# EAGLE design Dodobot (EAGLE 9.6.2)
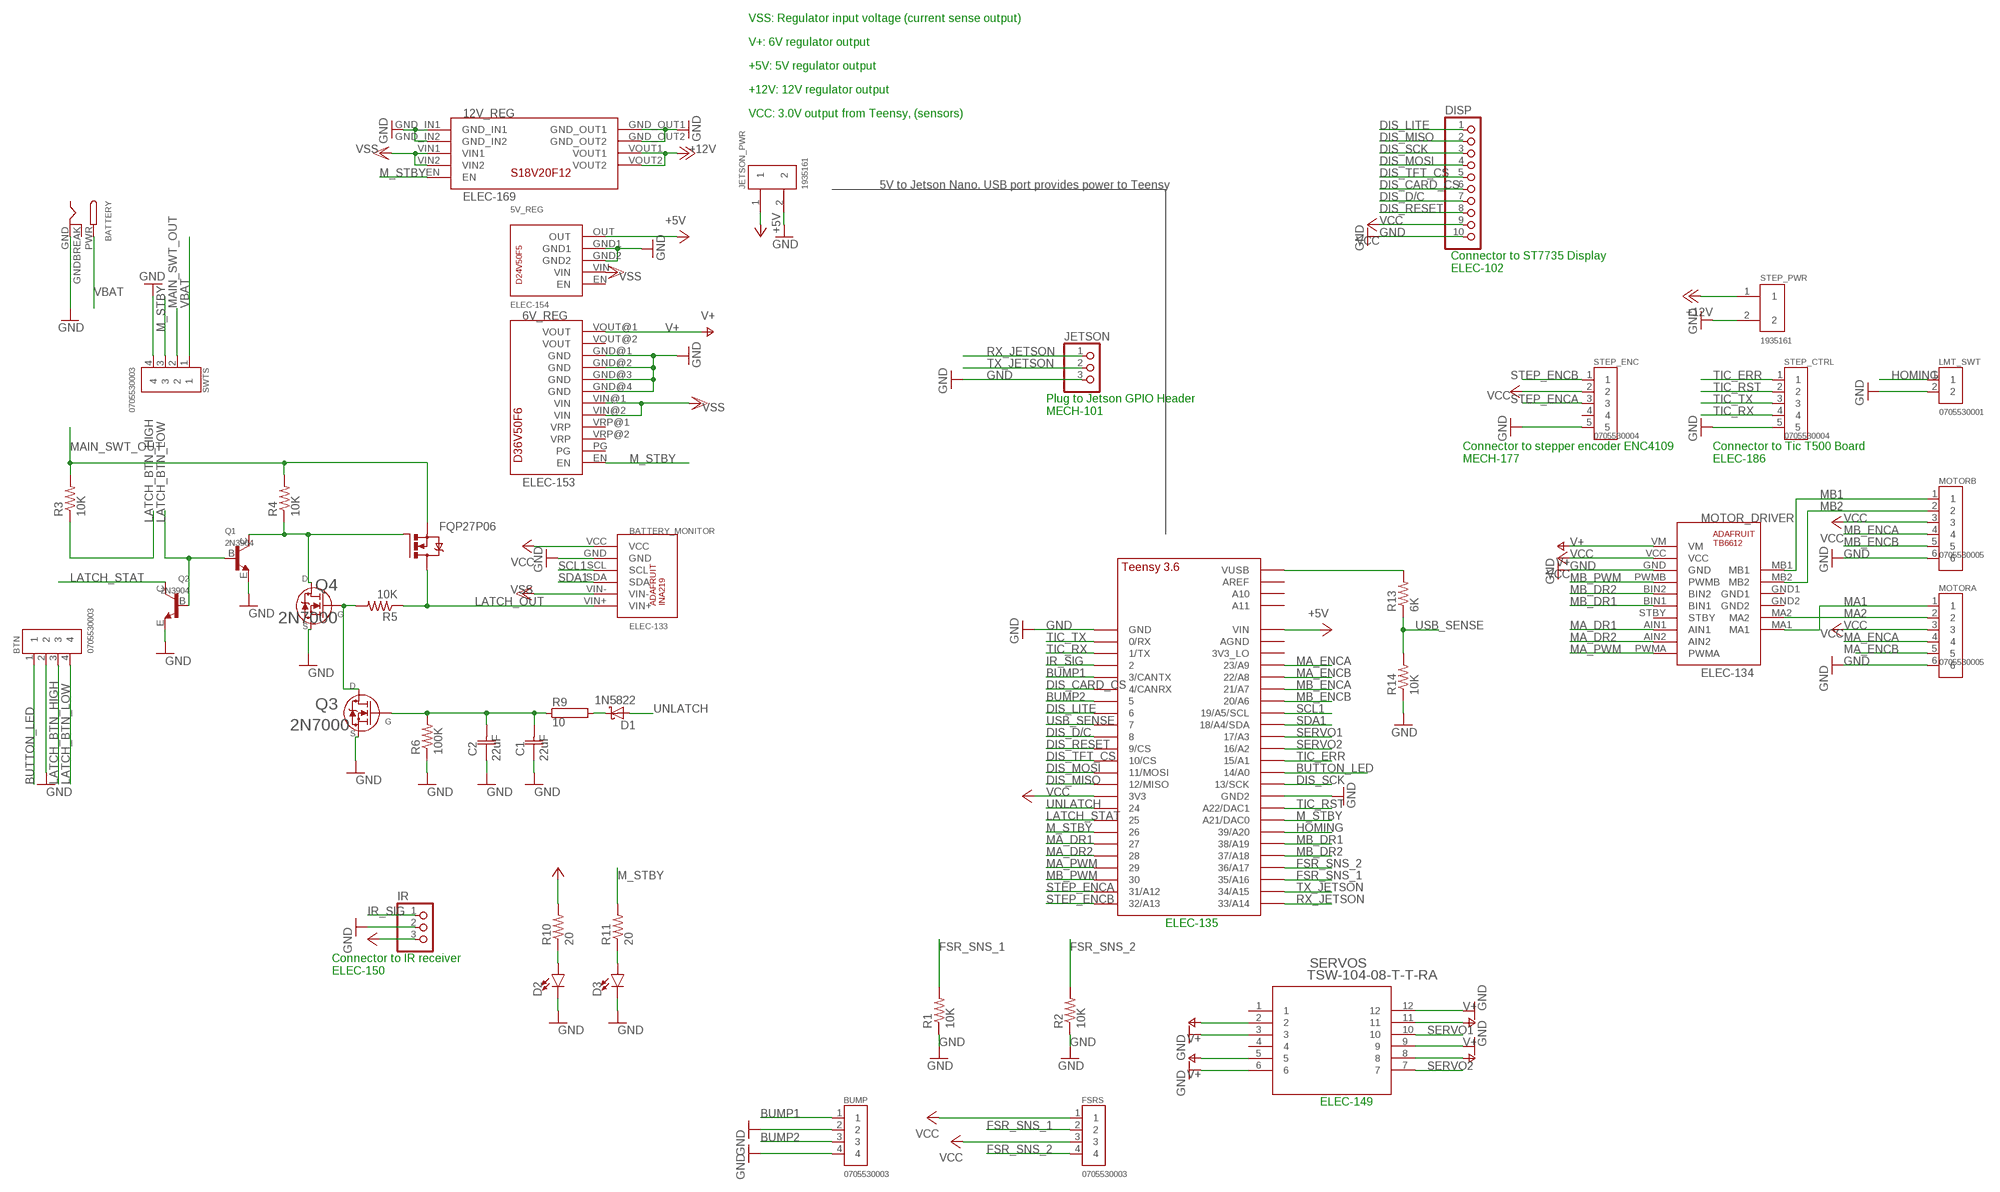
[diagram p0: schematic, sheet 1]

## Parts
5V_REG  ELEC-154  D24V50F5  [D24V50F5]
6V_REG  ELEC-153  D36V50FX  [D36V50FX]
12V_REG  ELEC-169  S18V20FX  [S18V20FX]
BATTERY  DCBARRELPTH  [DCJACK_2MM_PTH]
BATTERY_MONITOR  ELEC-133  INA219  [INA219]
BTN  0705530003  [MOLEX_0705530003]
BUMP  0705530003  [MOLEX_0705530003]
C1  22uF  FK24X5R0J226M  [CAP_R4525B]
C2  22uF  FK24X5R0J226M  [CAP_R4525B]
D1  1N5822  [DIOAD2120W130L950D530P]
D2  LED1206  [LED-1206]
D3  LED1206  [LED-1206]
DISP  PINHD-1X10  [1X10]
FQP27P06  IRF530  [TO220BV]
FSRS  0705530003  [MOLEX_0705530003]
IR  PINHD-1X3  [1X03]
JETSON  PINHD-1X3  [1X03]
JETSON_PWR  1935161  [PHOENIX_1935161]
LMT_SWT  0705530001  [MOLEX_0705530001]
MOTOR_DRIVER  ELEC-134  ADAFRUIT_TB6612  [ADAFRUIT_TB6612]
MOTORA  0705530005  [MOLEX_0705530005]
MOTORB  0705530005  [MOLEX_0705530005]
Q1  2N3904  [TO92]
Q2  2N3904  [TO92]
Q3  2N7000  [TO-92]
Q4  2N7000  [TO-92]
R1  10K  CRCW08050000Z0EA  [RES_0805]
R2  10K  CRCW08050000Z0EA  [RES_0805]
R3  10K  CRCW08050000Z0EA  [RES_0805]
R4  10K  CRCW08050000Z0EA  [RES_0805]
R5  10K  CRCW08050000Z0EA  [RES_0805]
R6  100K  CRCW08050000Z0EA  [RES_0805]
R9  10  RHPS58  [HPS58]
R10  20  WSLP1206R0500FEA  [RES_1206]
R11  20  WSLP1206R0500FEA  [RES_1206]
R13  6K  CRCW08050000Z0EA  [RES_0805]
R14  10K  CRCW08050000Z0EA  [RES_0805]
SERVOS  TSW-104-08-T-T-RA  [TSW-104-08-T-T-RA_SAI]
STEP_CTRL  0705530004  [MOLEX_0705530004]
STEP_ENC  0705530004  [MOLEX_0705530004]
STEP_PWR  1935161  [PHOENIX_1935161]
SWTS  0705530003  [MOLEX_0705530003]
U$1  TEENSY_3.5/3.6_BASIC  [TEENSY_3.5/3.6_BASIC]

## Nets
+5V: 5V_REG.OUT JETSON_PWR.1 U$1.VIN
+12V: 12V_REG.VOUT1 12V_REG.VOUT2 STEP_PWR.1
BUMP1: BUMP.1 U$1.3/CANTX
BUMP2: BUMP.3 U$1.5
BUTTON_LED: BTN.1 U$1.14/A0
DIS_CARD_CS: DISP.6 U$1.4/CANRX
DIS_D/C: DISP.7 U$1.8
DIS_LITE: DISP.1 U$1.6
DIS_MISO: DISP.2 U$1.12/MISO
DIS_MOSI: DISP.4 U$1.11/MOSI
DIS_RESET: DISP.8 U$1.9/CS
DIS_SCK: DISP.3 U$1.13/SCK
DIS_TFT_CS: DISP.5 U$1.10/CS
FSR_SNS_1: FSRS.2 R1.2 U$1.35/A16
FSR_SNS_2: FSRS.4 R2.2 U$1.36/A17
GND [ground]: 5V_REG.GND1 5V_REG.GND2 6V_REG.GND@1(GND) 6V_REG.GND@2(GND) 6V_REG.GND@3(GND) 6V_REG.GND@4(GND) 12V_REG.GND_IN1 12V_REG.GND_IN2 12V_REG.GND_OUT1 12V_REG.GND_OUT2 BATTERY.GND BATTERY_MONITOR.GND BTN.2 BUMP.2 BUMP.4 C1.1 C2.1 D2.C D3.C DISP.10 IR.2 JETSON.3 JETSON_PWR.2 LMT_SWT.2 MOTOR_DRIVER.GND MOTORA.6 MOTORB.6 Q1.E Q2.E Q3.1 Q4.1 R1.1 R2.1 R6.1 R14.1 SERVOS.3 SERVOS.6 SERVOS.9 SERVOS.12 STEP_CTRL.5 STEP_ENC.5 STEP_PWR.2 SWTS.4 U$1.GND U$1.GND2
HOMING: LMT_SWT.1 U$1.39/A20
IR_SIG: IR.1 U$1.2
LATCH_BTN_HIGH: BTN.3 R3.1
LATCH_BTN_LOW: BTN.4 Q1.B Q2.B
LATCH_OUT: BATTERY_MONITOR.VIN+ FQP27P06.D R5.1
LATCH_STAT: Q2.C U$1.25
M_STBY: 6V_REG.EN 12V_REG.EN R11.2 SWTS.3 U$1.21/DAC0(A21/DAC0) U$1.26
MA1 [power]: MOTOR_DRIVER.MA1 MOTORA.1
MA2: MOTOR_DRIVER.MA2 MOTORA.2
MA_DR1: MOTOR_DRIVER.AIN1 U$1.27
MA_DR2: MOTOR_DRIVER.AIN2 U$1.28
MA_ENCA: MOTORA.4 U$1.23/A9
MA_ENCB: MOTORA.5 U$1.22/A8
MA_PWM: MOTOR_DRIVER.PWMA U$1.29
MAIN_SWT_OUT: FQP27P06.S R3.2 R4.2 SWTS.2
MB1 [power]: MOTOR_DRIVER.MB1 MOTORB.1
MB2: MOTOR_DRIVER.MB2 MOTORB.2
MB_DR1: MOTOR_DRIVER.BIN1 U$1.38/A19
MB_DR2: MOTOR_DRIVER.BIN2 U$1.37/A18
MB_ENCA: MOTORB.4 U$1.21/A7
MB_ENCB: MOTORB.5 U$1.20/A6
MB_PWM: MOTOR_DRIVER.PWMB U$1.30
N$2: D2.A R10.1
N$3: D3.A R11.1
N$8: FQP27P06.G Q1.C Q4.3 R4.1
N$9: Q3.3 Q4.2 R5.2
N$10: D1.C R9.2
N$11: C1.2 C2.2 Q3.2 R6.2 R9.1
N$14: R13.2 U$1.VUSB
RX_JETSON: JETSON.1 U$1.33/A14
SCL1: BATTERY_MONITOR.SCL U$1.19/A5/SCL
SDA1: BATTERY_MONITOR.SDA U$1.18/A4/SDA
SERVO1: SERVOS.10 U$1.17/A3
SERVO2: SERVOS.7 U$1.16/A2
STEP_ENCA: STEP_ENC.3 U$1.31/A12
STEP_ENCB: STEP_ENC.1 U$1.32/A13
TIC_ERR: STEP_CTRL.1 U$1.15/A1
TIC_RST: STEP_CTRL.2 U$1.A22/DAC1
TIC_RX: STEP_CTRL.4 U$1.1/TX
TIC_TX: STEP_CTRL.3 U$1.0/RX
TX_JETSON: JETSON.2 U$1.34/A15
UNLATCH: D1.A U$1.24
USB_SENSE: R13.1 R14.2 U$1.7
V+: 6V_REG.VOUT@1(VOUT) MOTOR_DRIVER.VM SERVOS.2 SERVOS.5 SERVOS.8 SERVOS.11
VBAT [power]: BATTERY.PWR SWTS.1
VCC: BATTERY_MONITOR.VCC DISP.9 FSRS.1 FSRS.3 IR.3 MOTOR_DRIVER.VCC MOTORA.3 MOTORB.3 R10.2 STEP_ENC.2 U$1.3V3
VSS [power]: 5V_REG.VIN 6V_REG.VIN@1(VIN) 6V_REG.VIN@2(VIN) 12V_REG.VIN1 12V_REG.VIN2 BATTERY_MONITOR.VIN-
Unconnected: 5V_REG.EN 6V_REG.PG 6V_REG.VOUT@2(VOUT) 6V_REG.VRP@1(VRP) 6V_REG.VRP@2(VRP) MOTOR_DRIVER.GND1 MOTOR_DRIVER.GND2 MOTOR_DRIVER.STBY SERVOS.1 SERVOS.4 STEP_ENC.4 U$1.3V3_LO U$1.A10 U$1.A11 U$1.AGND U$1.AREF

## Notes on the sheet
- VSS: Regulator input voltage (current sense output)
- V+: 6V regulator output
- +5V: 5V regulator output
- +12V: 12V regulator output
- VCC: 3.0V output from Teensy, (sensors)
- 5V to Jetson Nano. USB port provides power to Teensy
- Connector to ST7735 Display
  ELEC-102
- Plug to Jetson GPIO Header
  MECH-101
- Connector to stepper encoder ENC4109
  MECH-177
- Connector to Tic T500 Board
  ELEC-186
- ELEC-135
- Connector to IR receiver
  ELEC-150
- ELEC-149

## Power pins joined to a net without a drawn wire
GNDBREAK: BATTERY.GNDBREAK

## Library data of the parts
5V_REG = D24V50F5:D24V50F5
6V_REG = D36V50Fx:D36V50FX
12V_REG = S18V20FX:S18V20FX
BATTERY = adafruit:DCBARREL: 2.0mm DC Barrel Jack DCJACK_2MM_PTH - Through Hole Jack (4UConnector: 05537)
BATTERY_MONITOR = adafruit_INA219:INA219
BTN BUMP FSRS SWTS = Molex Right Angle 4 position 0705530003:0705530003: Conn Shrouded Header HDR 4 POS 2.54mm Solder RA Thru-Hole; DESCRIPTION: Connector Header Through Hole, Right Angle 4 position 0.100 (2.54mm); DIGI-KEY_PART_NUMBER: WM4902-ND; MF: Molex; MP: 0705530003; PACKAGE: None
C1 C2 = FK24X5R0J226M:FK24X5R0J226M; BUILT_BY: EMA_UL_Team; MANUFACTURER_PART_NUMBER: FK24X5R0J226M; VENDOR: TDK
D1 = 1N5822:1N5822: 1N5822 Series 40 V 3 A Through Hole Schottky Rectifier - DO-201AD; DIGI-KEY_PART_NUMBER: 1N5822FSCT-ND; DIGI-KEY_PURCHASE_URL: https://www.digikey.com/product-detail/en/on-semiconductor/1N5822/1N5822FSCT-ND/3042493?utm_source=snapeda&utm_medium=aggregator&utm_campaign=symbol; MF: ON Semiconductor; MP: 1N5822; PACKAGE: DO-201AD-201 CDIL
D2 D3 = SparkFun-LED:LED: LED (Generic) Standard schematic elements and footprints for 5mm, 3mm, 1206, and 0603 sized LEDs. Generic LEDs with no color specified.
DISP = pinhead:PINHD-1X10: PIN HEADER
FQP27P06 = IRF530:IRF530: HEXFET Power MOSFET; AVAILABILITY: Unavailable; MF: Vishay Siliconix; MP: IRF530; PACKAGE: TO-220-3 Samsung; PRICE: None
IR JETSON = pinhead:PINHD-1X3: PIN HEADER
JETSON_PWR STEP_PWR = 1935161:1935161: Conn Terminal Blocks 2 POS 5mm Solder ST Thru-Hole 16A; DESCRIPTION: Conn Terminal Blocks 2 POS 5mm Solder ST Thru-Hole 16A; DIGI-KEY_PART_NUMBER: 277-1667-ND; DIGI-KEY_PURCHASE_URL: https://www.digikey.com/product-detail/en/phoenix-contact/1935161/277-1667-ND/568614?utm_source=snapeda&utm_medium=aggregator&utm_campaign=symbol; MF: Phoenix Contact; MP: 1935161; PACKAGE: None
LMT_SWT = Molex Right Angle 4 position 0705530003:0705530001
MOTOR_DRIVER = adafruit_TB6612:ADAFRUIT_TB6612
MOTORA MOTORB = Molex Right Angle 4 position 0705530003:0705530005
Q1 Q2 = 2N3904:2N3904
Q3 Q4 = 2N7000:2N7000; BUILT_BY: EMA_UL_Team; MANUFACTURER_PART_NUMBER: 2N7000; VENDOR: STMicroelectronics
R1-R6 R13 R14 = Resistor_Capacitor:CRCW08050000Z0EA: RES SMD 0 OHM JUMPER 1/8W 0805 Manufacturer's datasheet <http://www.vishay.com/docs/20035/dcrcwe3.pdf>; CREATED_BY: PCBLayout.com; DIGIKEY_PART_NUMBER: 541-0.0ATR-ND; MANUFACTURER: Vishay Dale; MPN: CRCW08050000Z0EA; PACKAGE: SMD 0805
R9 = resistor-power:R: Power Resitor; OC_FARNELL: unknown; OC_NEWARK: unknown
R10 R11 = Resistor_Capacitor:WSLP1206R0500FEA: RES 0.05 OHM 1% 1W 1206 Manufacturer's datasheet <http://www.vishay.com/docs/30122/wslp.pdf>; CREATED_BY: PCBLayout.com; DIGIKEY_PART_NUMBER: WSLP-.05TR-ND; MANUFACTURER: Vishay Dale; MPN: WSLP1206R0500FEA; PACKAGE: SMD 1206
SERVOS = 4X3 Header Pin:TSW-104-08-T-T-RA; BUILT_BY: EMA_UL_Team; MANUFACTURER_PART_NUMBER: TSW-104-08-T-T-RA; SOURCELIBRARY: Samtec_2016-10-07_8; VENDOR: Samtec Inc
STEP_CTRL STEP_ENC = Molex Right Angle 4 position 0705530003:0705530004
U$1 = Teensy356:TEENSY_3.5/3.6_BASIC

## Net classes
0 default: width 0.203 mm, drill 0.152 mm, clearance 0.102 mm
1 power: width 0.813 mm, drill 0.61 mm, clearance 0.203 mm
2 ground: width 0.813 mm, drill 0.61 mm, clearance 0.203 mm

## Board
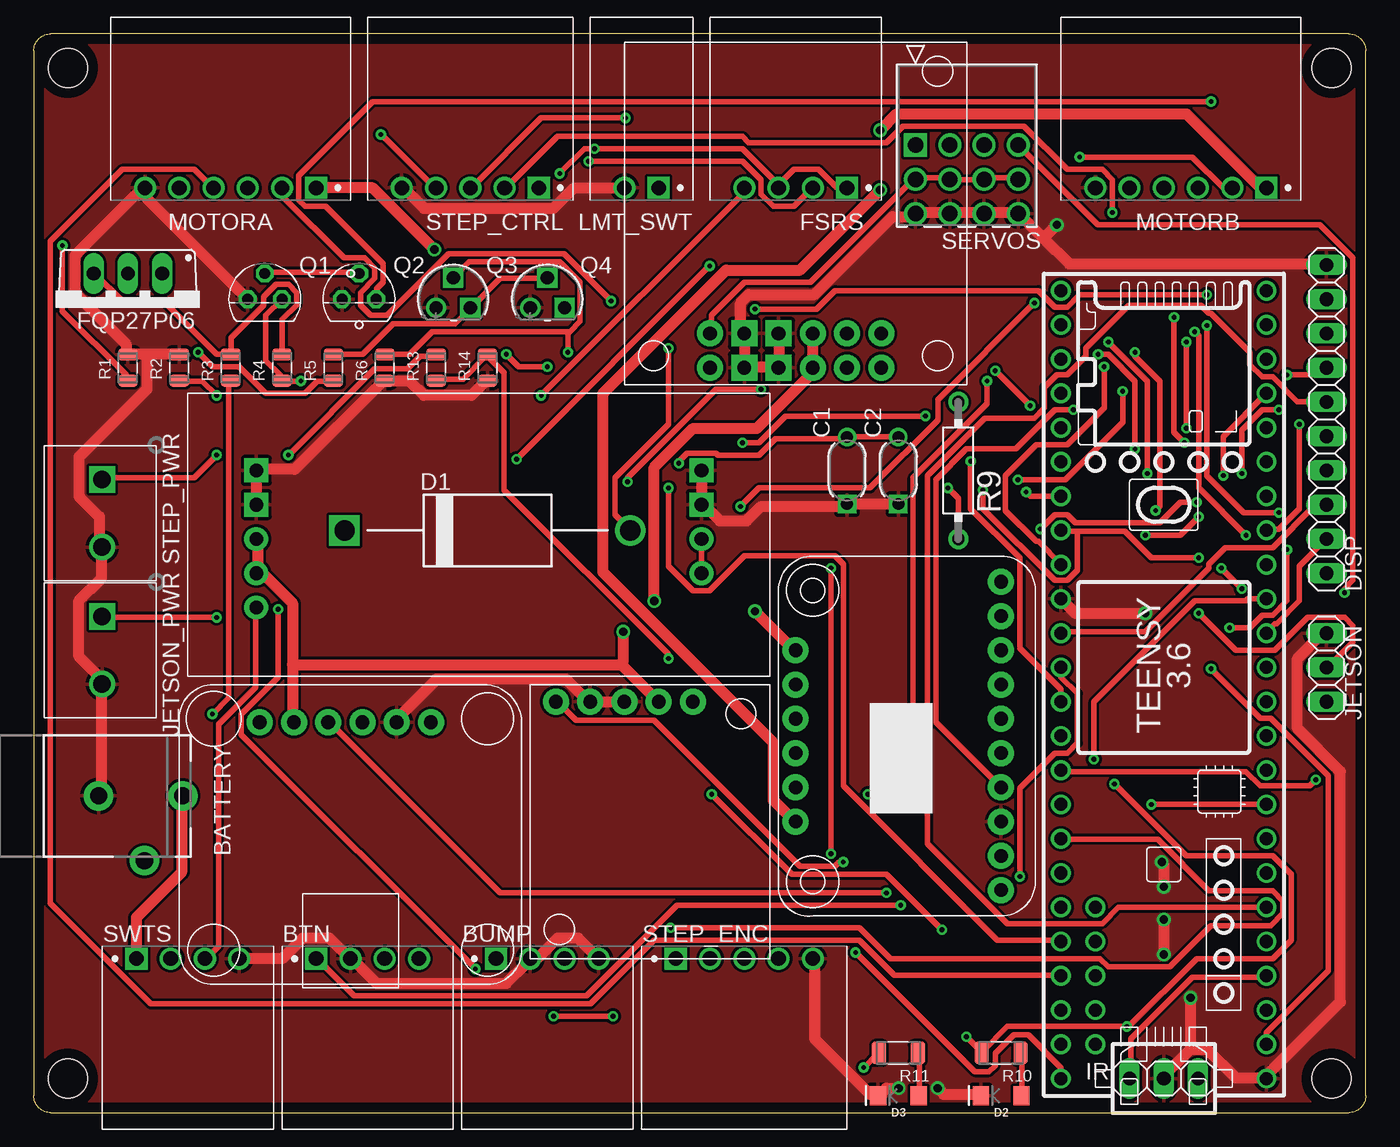
[diagram p1: board, top side]
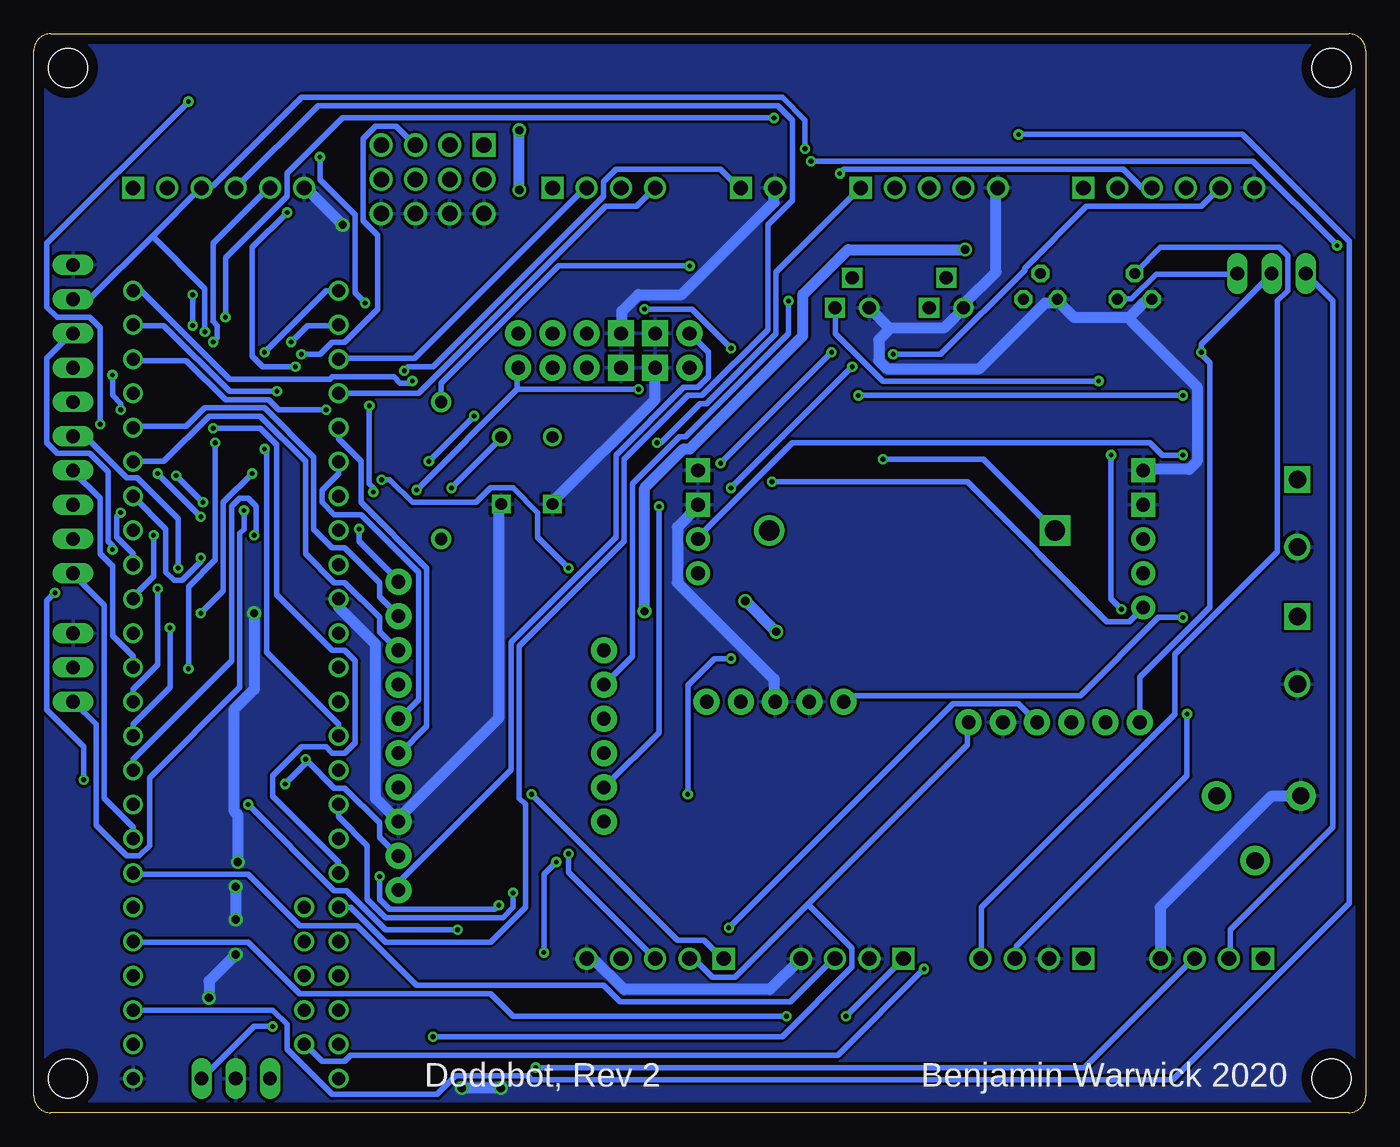
[diagram p2: board, bottom side, seen from below]

Size 98.81 x 80.01 mm. Coordinates in mm from the lower left corner, seen from the top.
Outline: 1.27,0 97.54,0 arc90 98.81,1.27 98.81,78.74 arc90 97.54,80.01 1.27,80.01 arc90 0,78.74 0,1.27 arc90 1.27,0
Copper layers (1*16): Top 0.035mm / dielectric 1.5mm / Bottom 0.035mm
Design rules "default *": minimum track width 16mil, minimum drill 0.35mm, track to track 8mil, track to pad 8mil, pad to pad 8mil, via to via 8mil, smd to smd 6mil, copper to edge 30mil, drill to drill 6mil, minimum pad ring 10mil, minimum via ring 8mil, stop-mask expansion 4mil, vias tented up to drill 0mil, thermal gap 10mil
Holes 2.92 mm at 2.54,77.47 96.27,77.47 2.54,2.54 96.27,2.54

### Footprints (pad centres in the part's own frame; a part is rotated, then mirrored left to right if it is on the bottom)
D24V50F5 = drill 1.016 pad 1.93: EN 5.715,1.27; GND1 10.795,1.27; GND2 13.335,1.27; OUT 15.875,1.27; VIN 8.255,1.27
D36V50FX = drill 1.016 pad 1.93: EN 19.05,1.27; PG 19.05,3.81; VIN@1 13.97,3.81; VIN@2 13.97,1.27; VOUT@1 6.35,3.81; VOUT@2 6.35,1.27; VRP@1 16.51,3.81; VRP@2 16.51,1.27 | drill 1.016 pad 1.93 square: GND@1 8.89,3.81; GND@2 8.89,1.27; GND@3 11.43,3.81; GND@4 11.43,1.27
S18V20FX = drill 1.016 pad 1.778: EN 5.08,5.08; VIN1 5.08,10.16; VIN2 5.08,7.62; VOUT1 38.1,10.16; VOUT2 38.1,7.62 | drill 1.016 pad 1.778 square: GND_IN1 5.08,15.24; GND_IN2 5.08,12.7; GND_OUT1 38.1,15.24; GND_OUT2 38.1,12.7
DCJACK_2MM_PTH = drill 1.27 pad 2.184: GND 0,7.35; GNDBREAK 4.8,10.75; PWR 0,13.6
INA219 = drill 1.016 pad 1.93: GND 9.271,2.794; SCL 11.811,2.794; SDA 14.351,2.794; VCC 6.731,2.794; VIN+ 19.431,2.794; VIN- 16.891,2.794
MOLEX_0705530003 = drill 1.09 square: 1 0,0 | drill 1.09: 2 2.54,0; 3 5.08,0; 4 7.62,0
CAP_R4525B = drill 0.864 pad 1.372 square: 1 -2.489,0 | drill 0.864 pad 1.372: 2 2.489,0
DIOAD2120W130L950D530P = drill 1.5 pad 2.25: A 10.6,0 | drill 1.5 pad 2.25 square: C -10.6,0
LED-1206 = smd 1.2 x 1.4: A -1.5,0; C 1.5,0
1X10 = drill 1.016 long: 1 -11.43,0; 2 -8.89,0; 3 -6.35,0; 4 -3.81,0; 5 -1.27,0; 6 1.27,0; 7 3.81,0; 8 6.35,0; 9 8.89,0; 10 11.43,0
TO220BV = drill 1.016 long: D 0,-2.54; G -2.54,-2.54; S 2.54,-2.54
1X03 = drill 1.016 long: 1 -2.54,0; 2 0,0; 3 2.54,0
PHOENIX_1935161 = drill 1.3 square: 1 -2.5,0 | drill 1.3: 2 2.5,0
MOLEX_0705530001 = drill 1.09 square: 1 0,0 | drill 1.09: 2 2.54,0
ADAFRUIT_TB6612 = drill 1.016 pad 1.93: AIN1 2.54,6.985; AIN2 2.54,4.445; BIN1 2.54,12.065; BIN2 2.54,14.605; GND 2.54,19.685; GND1 17.78,14.605; GND2 17.78,12.065; MA1 17.78,6.985; MA2 17.78,9.525; MB1 17.78,19.685; MB2 17.78,17.145; PWMA 2.54,1.905; PWMB 2.54,17.145; STBY 2.54,9.525; VCC 2.54,22.225; VM 2.54,24.765
MOLEX_0705530005 = drill 1.09 square: 1 0,0 | drill 1.09: 2 2.54,0; 3 5.08,0; 4 7.62,0; 5 10.16,0; 6 12.7,0
TO92 = drill 0.813 octagon: B 0,1.905; C 1.27,0; E -1.27,0
TO-92 = drill 0.991 pad 1.499: 1 -2.54,-1.905 | drill 0.991 pad 1.499 square: 2 -1.27,0.318; 3 0,-1.905
RES_0805 = smd 0.87 x 1.42: 1 -0.975,0; 2 0.975,0
HPS58 = drill 0.9 pad 1.5: 1 -5.08,0; 2 5.08,0
RES_1206 = smd 1.08 x 1.68: 1 -1.445,0; 2 1.445,0
TSW-104-08-T-T-RA_SAI = drill 1.143 pad 1.651 square: 1 0,0 | drill 1.143 pad 1.651: 2 0,-2.54; 3 0,-5.08; 4 2.54,0; 5 2.54,-2.54; 6 2.54,-5.08; 7 5.08,0; 8 5.08,-2.54; 9 5.08,-5.08; 10 7.62,0; 11 7.62,-2.54; 12 7.62,-5.08
MOLEX_0705530004 = drill 1.09 square: 1 0,0 | drill 1.09: 2 2.54,0; 3 5.08,0; 4 7.62,0; 5 10.16,0
TEENSY_3.5/3.6_BASIC = drill 0.965: 0/RX -25.4,-7.62; 1/TX -22.86,-7.62; 2 -20.32,-7.62; 3/CANTX -17.78,-7.62; 3V3 7.62,-7.62; 3V3_LO -22.86,7.62; 4/CANRX -15.24,-7.62; 5 -12.7,-7.62; 6 -10.16,-7.62; 7 -7.62,-7.62; 8 -5.08,-7.62; 9/CS -2.54,-7.62; 10/CS 0,-7.62; 11/MOSI 2.54,-7.62; 12/MISO 5.08,-7.62; 13/SCK 5.08,7.62; 14/A0 2.54,7.62; 15/A1 0,7.62; 16/A2 -2.54,7.62; 17/A3 -5.08,7.62; 18/A4/SDA -7.62,7.62; 19/A5/SCL -10.16,7.62; 20/A6 -12.7,7.62; 21/A7 -15.24,7.62; 21/DAC0 12.7,7.62; 22/A8 -17.78,7.62; 23/A9 -20.32,7.62; 24 10.16,-7.62; 25 12.7,-7.62; 26 15.24,-7.62; 27 17.78,-7.62; 28 20.32,-7.62; 29 22.86,-7.62; 30 25.4,-7.62; 31/A12 27.94,-7.62; 32/A13 30.48,-7.62; 33/A14 30.48,7.62; 34/A15 27.94,7.62; 35/A16 25.4,7.62; 36/A17 22.86,7.62; 37/A18 20.32,7.62; 38/A19 17.78,7.62; 39/A20 15.24,7.62; A10 -17.78,5.08; A11 -15.24,5.08; A22/DAC1 10.16,7.62; AGND -25.4,7.62; AREF -20.32,5.08; GND -27.94,-7.62; GND2 7.62,7.62; NC1 -22.86,5.08; VIN -27.94,7.62; VUSB -25.4,5.08

### Placement (x,y rotation side)
5V_REG  54.61,31.75 180 top
6V_REG  43.81,53.98 0 top
12V_REG  11.43,32.38 0 top
BATTERY  -2.54,23.5 270 top
BATTERY_MONITOR  36.2,31.75 180 top
BTN  20.95,11.43 0 top
BUMP  34.29,11.43 0 top
C1  60.33,47.62 90 top
C2  64.14,47.62 90 top
D1  33.66,43.18 0 top
D2  71.75,1.27 180 top
D3  64.14,1.27 180 top
DISP  95.89,51.44 90 top
FQP27P06  6.99,59.69 180 top
FSRS  60.33,68.58 180 top
IR  83.82,2.54 0 top
JETSON  95.89,33.02 90 top
JETSON_PWR  5.08,34.29 270 top
LMT_SWT  46.35,68.58 180 top
MOTOR_DRIVER  74.3,41.27 180 top
MOTORA  20.95,68.58 180 top
MOTORB  91.44,68.58 180 top
Q1  17.14,60.33 0 top
Q2  24.13,60.33 0 top
Q3  32.38,61.59 0 top
Q4  39.37,61.59 0 top
R1  6.99,55.24 270 top
R2  10.79,55.24 270 top
R3  14.61,55.24 90 top
R4  18.41,55.24 90 top
R5  22.23,55.24 90 top
R6  26.04,55.24 90 top
R9  68.58,47.62 90 top
R10  71.75,4.45 180 top
R11  64.14,4.45 180 top
R13  29.84,55.24 90 top
R14  33.66,55.24 90 top
SERVOS  65.41,71.75 0 top
STEP_CTRL  37.47,68.58 180 top
STEP_ENC  47.62,11.43 0 top
STEP_PWR  5.08,44.45 270 top
SWTS  7.62,11.43 0 top
U$1  83.82,30.48 90 top

### Tracks (layer width: path | path; a pad name or v marks a point on that pad's centre or on a via)
+5V  (via drill 0.35)
  Top 0.406: U$1.VIN 76.2,3.35 73.76,5.79 72.69,5.79 71.32,4.42 71.32,3.5 70.87,3.05 69.8,3.05 v60.96,11.89 | v60.05,18.59 59.74,18.59 59.44,18.29 56.84,18.29 46.02,29.11 40.23,29.11 38.86,30.48 5V_REG.OUT | v13.56,36.73 5.18,36.73 JETSON_PWR.1
  Bottom 0.406: v60.96,11.89 60.96,17.68 v60.05,18.59 | v13.56,36.73 15.39,36.73 21.18,30.94 38.25,30.94 38.71,30.48 5V_REG.OUT
+12V  (via drill 0.35)
  Top 0.406: 12V_REG.VOUT1 12V_REG.VOUT2 | v13.56,48.77 11.89,47.09 5.18,47.09 STEP_PWR.1
  Bottom 0.406: v13.56,48.77 15.09,48.77 16,49.68 42.52,49.68 49.53,42.67 12V_REG.VOUT1
BUMP1  (via drill 0.35)
  Top 0.406: v38.56,7.16 v42.98,7.16
  Bottom 0.406: v42.98,7.16 63.25,7.16 64.92,8.84 79.1,8.84 82.91,12.65 91.44,12.65 U$1.3/CANTX | BUMP.1 v38.56,7.16
BUMP2
  Bottom 0.406: U$1.5 91.44,17.68 82.91,17.68 79.1,13.87 74.83,13.87 70.41,9.45 56.54,9.45 55.32,8.23 42.67,8.23 39.47,11.43 BUMP.3
BUTTON_LED  (via drill 0.35)
  Top 0.406: U$1.14/A0 76.2,32.31 77.42,31.09 77.42,27.43 76.66,26.67 75.74,26.67 73.15,24.08 v73.15,17.53 | v64.31,15.39 47.7,15.39 41,8.69 23.77,8.69 21.03,11.43 BTN.1
  Bottom 0.406: v73.15,17.53 73.15,15.85 72.39,15.09 64.62,15.09 v64.31,15.39
DIS_CARD_CS
  Top 0.406: U$1.4/CANRX 80.47,15.24 79.25,14.02 72.24,14.02 66.29,19.96 66.29,47.24 70.56,51.51 74.22,51.51 74.98,52.27 74.98,53.8 75.89,54.71 76.66,54.71 78.03,56.08 78.03,56.69 81.23,59.89 86.56,59.89 87.17,59.28 87.33,59.28 90.22,56.39 90.22,55.47 91.14,54.56 91.9,54.56 93.73,52.73 95.86,52.73 DISP.6
DIS_D/C  (via drill 0.35)
  Top 0.406: v82.45,42.82 85.04,42.82 v86.41,44.2 | v89.61,47.4 89.61,50.6 91.14,52.12 v92.35,52.12 | v92.96,54.71 95.4,54.71 95.86,55.17 DISP.7
  Bottom 0.406: U$1.8 91.44,26.21 84.12,33.53 84.12,44.96 83.52,45.57 82.91,45.57 82.3,44.96 82.3,42.98 v82.45,42.82 | v89.61,47.4 v86.41,44.2 | v92.35,52.12 92.35,52.58 92.96,53.19 v92.96,54.71
DIS_LITE
  Bottom 0.406: U$1.6 91.44,21.18 93.57,23.32 93.57,37.64 95.86,39.93 DISP.1
DIS_MISO
  Top 0.406: DISP.2 93.88,40.54 93.88,37.95 92.2,36.27 92.05,36.27 91.44,35.66 U$1.12/MISO
DIS_MOSI
  Bottom 0.406: U$1.11/MOSI 91.44,33.83 92.96,35.36 92.96,40.54 93.88,41.45 93.88,45.57 95.86,47.55 DISP.4
DIS_RESET  (via drill 0.35)
  Top 0.406: v88.7,35.97 90.22,35.97 91.14,36.88 91.9,36.88 92.96,37.95 v92.96,41.76
  Bottom 0.406: U$1.9/CS 91.44,28.8 88.7,31.55 v88.7,35.97 | v92.96,41.76 92.96,42.06 93.27,42.37 93.27,47.55 94.64,48.92 97.08,48.92 97.84,49.68 97.84,55.93 96.01,57.76 DISP.8
DIS_SCK
  Top 0.406: U$1.13/SCK 76.2,35.66 82.45,35.66 87.17,40.39 87.17,40.69 88.39,41.91 91.9,41.91 94.94,44.96 95.86,44.96 DISP.3
DIS_TFT_CS  (via drill 0.35)
  Top 0.406: v88.09,40.39 v89.61,38.86
  Bottom 0.406: U$1.10/CS 91.44,31.39 89.61,33.22 v89.61,38.86 | v88.09,40.39 88.09,44.04 91.14,47.09 91.9,47.09 94.94,50.14 95.86,50.14 DISP.5
FSR_SNS_1  (via drill 0.35)
  Top 0.406: v2.13,64.31 2.13,59.44 6.86,54.71 6.86,54.41 R1.2 | v41.15,70.56 52.58,70.56 53.95,69.19 53.95,68.12 54.86,67.21 56.39,67.21 57.76,68.58 FSRS.2
  Bottom 0.406: v2.13,64.31 8.38,70.56 v41.15,70.56 | U$1.35/A16 76.2,55.93 70.56,55.93 57.91,68.58 FSRS.2
FSR_SNS_2  (via drill 0.35)
  Top 0.406: v13.56,53.19 12.5,54.25 10.82,54.25 R2.2 | v37.64,53.19 52.58,68.12 52.58,68.58 FSRS.4
  Bottom 0.406: v37.64,53.19 v13.56,53.19 | U$1.36/A17 70.26,53.34 56.39,67.21 54.1,67.21 52.73,68.58 FSRS.4
GND  (via drill 0.61)
  Top 0.813: STEP_ENC.5 57.91,11.43 57.91,5.49 62.03,1.37 62.48,1.37 D3.C 62.94,1.52 63.25,1.83 v64.16,1.83 | v67.06,1.83 67.51,1.37 70.1,1.37 D2.C | BUMP.4 40.39,12.95 38.86,12.95 37.34,11.43 BUMP.2 36.58,11.12 35.05,9.6 25.45,9.6 23.77,11.28 BTN.2 23.47,11.43 21.95,12.95 19.96,12.95 18.44,11.43 SWTS.4 | BATTERY.GND 4.88,23.62 5.03,23.77 5.03,31.7 JETSON_PWR.2 5.03,32.16 3.35,33.83 3.35,37.95 5.03,39.62 5.03,41.91 STEP_PWR.2 4.88,42.22 4.88,44.2 3.35,45.72 3.35,48.62 8.38,53.65 8.38,56.24 | R14.1 33.53,54.25 32.46,53.19 28.96,53.19 27.89,54.25 26.06,54.25 R6.1 25.76,54.1 19.36,47.7 16.61,47.7 12V_REG.GND_IN1 12V_REG.GND_IN2 | 8.38,56.24 10.67,56.24 R2.1 | 8.38,56.24 7.01,56.24 R1.1 6.86,56.54 6.86,57 3.05,60.81 3.05,63.55 8.08,68.58 MOTORA.6 8.08,68.12 Q1.E | 85.8,4.72 87.02,4.72 89.15,2.59 91.44,2.59 U$1.GND 91.59,2.9 96.93,8.23 96.93,25.3 93.73,28.5 93.73,33.68 95.56,35.51 95.86,35.51 JETSON.3 | 85.8,4.72 83.82,2.74 IR.2 | 74.91,64.85 73.15,66.6 SERVOS.12 72.69,66.75 70.56,66.75 SERVOS.9 70.1,66.75 68.28,66.75 SERVOS.6 67.82,66.75 65.53,66.75 SERVOS.3 65.08,66.45 63.7,66.45 57.91,60.66 53.03,60.66 52.43,60.05 52.43,58.06 6V_REG.GND@1 52.73,57.76 52.73,55.32 6V_REG.GND@2 53.03,55.32 55.17,55.32 6V_REG.GND@4 55.32,55.63 55.32,57.76 6V_REG.GND@3 | 74.91,64.85 76.81,62.94 95.86,62.94 DISP.10 | 74.91,64.85 v75.89,65.84 | LMT_SWT.2 40.08,68.58 38.56,67.06 28.96,67.06 27.43,68.58 STEP_CTRL.5 | BATTERY_MONITOR.GND 26.98,28.96 26.98,29.26 29.87,32.16 39.47,32.16 41.15,30.48 5V_REG.GND2 5V_REG.GND1 | C2.1 64.01,45.11 60.35,45.11 C1.1 60.05,44.96 53.95,44.96 52.88,43.89 50.9,43.89 49.84,44.96 12V_REG.GND_OUT2 12V_REG.GND_OUT1
  Top 0.813: v85.8,8.53 85.8,4.72 | v83.82,14.33 v83.82,11.73 | v83.82,16.76 83.82,18.44 v83.67,18.59 | v82.45,37.03 77.27,37.03 U$1.GND2
  Bottom 0.813: v64.16,1.83 v67.06,1.83 | STEP_ENC.5 57.3,11.43 55.02,9.14 44.2,9.14 BUMP.4 | 17.53,58.98 16.31,60.2 16,60.2 Q1.E | 17.53,58.98 21.64,58.98 22.86,60.2 Q2.E 23.16,60.05 23.77,60.05 28.65,55.17 35.51,55.17 36.12,55.78 36.12,57.3 35.51,57.91 35.36,58.22 | 12V_REG.GND_IN1 16.46,47.7 13.11,47.7 12.5,48.31 12.5,53.8 17.37,58.67 17.53,58.98 | SWTS.4 15.24,15.24 7.01,23.47 4.88,23.47 BATTERY.GND | v75.89,65.84 78.64,68.58 MOTORB.6 | 35.36,58.22 31.24,58.22 29.87,59.59 Q3.1 29.72,60.05 27.43,62.33 27.43,68.58 STEP_CTRL.5 | Q4.1 35.36,58.22 | U$1.GND2 76.2,37.49 73.46,34.75 73.46,23.32 71.78,21.64 MOTOR_DRIVER.GND 71.63,21.95 64.31,29.26 64.31,44.96 C2.1 | 6V_REG.GND@2 52.73,55.17 52.73,52.88 60.35,45.26 C1.1 | 5V_REG.GND1 43.89,30.48 43.89,32.16 51.05,39.32 51.05,43.43 49.53,44.96 12V_REG.GND_OUT2 | LMT_SWT.2 43.89,68.58 43.89,67.51 50.75,60.66 53.95,60.66 55.17,59.44 55.17,57.91 6V_REG.GND@3 | v85.8,8.53 85.8,9.75 v83.82,11.73 | v83.82,16.76 v83.82,14.33 | v83.67,18.59 83.67,22.1 83.97,22.4 83.97,29.87 82.45,31.39 v82.45,37.03
  pour Top: 0,0 99.06,0 99.06,80.01 0,80.01
  pour Bottom: 0,0 99.06,0 99.06,80.01 0,80.01
HOMING  (via drill 0.35)
  Top 0.406: U$1.39/A20 73.91,45.72 v73.61,46.02 | v71.32,55.02 v73.91,52.43
  Bottom 0.406: v73.61,46.02 73.61,46.33 73.91,46.63 v73.91,52.43 | v71.32,55.02 71.02,55.32 69.19,55.32 56.54,67.97 56.54,69.04 55.63,69.95 47.85,69.95 46.48,68.58 LMT_SWT.1
IR_SIG
  Top 0.406: U$1.2 91.44,10.06 85.95,10.06 81.38,5.49 81.38,2.59 IR.1
LATCH_BTN_HIGH  (via drill 0.35)
  Top 0.406: v13.26,29.57 14.48,30.79 14.48,54.25 R3.1
  Bottom 0.406: v13.26,29.57 13.26,24.99 25.91,12.34 25.91,11.43 BTN.3
LATCH_BTN_LOW
  Top 0.406: Q1.B 17.22,62.33 24.08,62.33 Q2.B
  Bottom 0.406: BTN.4 28.5,11.43 28.5,15.24 14.17,29.57 14.17,33.98 6.55,41.6 6.55,60.2 5.79,60.96 5.79,63.55 6.4,64.16 15.24,64.16 17.07,62.33 Q1.B
LATCH_OUT  (via drill 0.35)
  Top 0.406: v12.19,56.39 13.26,55.32 15.24,55.32 17.22,53.34 20.12,53.34 21.03,54.25 22.1,54.25 R5.1
  Bottom 0.406: FQP27P06.D 7.01,62.18 12.19,57 v12.19,56.39 12.19,56.24 11.58,55.63 11.58,37.49 16.76,32.31 BATTERY_MONITOR.VIN+
LATCH_STAT  (via drill 0.35)
  Top 0.406: v87.33,74.98 25.15,74.98 19.66,69.49 19.66,67.67 20.12,67.21 21.64,67.21 25.91,62.94 25.91,61.57 25.45,61.11 25.45,60.35 Q2.C | v93.88,51.05 93.88,44.81 92.35,43.28 91.44,43.28 U$1.25
  Bottom 0.406: v87.33,74.98 97.84,64.47 97.84,59.74 97.08,58.98 94.64,58.98 93.88,58.22 v93.88,51.05
M_STBY  (via drill 0.35)
  Top 0.406: 77.42,43.13 80.92,43.13 82.91,41.15 v86.41,41.15 | 77.42,43.13 76.2,43.13 U$1.21/DAC0 | v70.41,46.18 70.41,44.81 75.74,39.47 76.66,39.47 77.42,40.23 77.42,43.13 | v61.57,3.35 62.64,4.42 R11.2 | 12V_REG.EN 16.46,37.34 16.46,31.55 13.72,28.8 13.72,12.34 12.8,11.43 SWTS.3 | v53.95,53.65 50.6,53.65 44.04,47.09 v44.04,46.79
  Bottom 0.406: v86.41,41.15 86.41,40.84 87.78,39.47 88.39,39.47 89,40.08 89,43.28 U$1.26 | 62.94,53.65 62.94,55.17 6V_REG.EN | v70.41,46.18 62.94,53.65 | v61.57,3.35 20.88,3.35 12.8,11.43 SWTS.3 | v53.95,53.65 62.94,53.65 | v44.04,46.79 29.57,46.79 19.2,36.42 17.53,36.42 16.61,37.34 12V_REG.EN
MA1  (via drill 0.61)
  Top 0.813: MOTORA.1 25.15,68.58 v29.72,64.01 | v53.49,37.19 56.39,34.29 MOTOR_DRIVER.MA1
  Bottom 0.813: v29.72,64.01 38.41,64.01 41.76,60.66 41.76,57.61 50.14,49.23 50.6,49.23 53.49,46.33 v53.49,37.19
MA2  (via drill 0.35)
  Top 0.406: v42.82,60.2 39.32,63.7 30.79,63.7 26.21,59.13 24.99,59.13 24.23,59.89 24.23,60.81 25.3,61.87 25.3,62.64 24.54,63.4 23.01,63.4 18.44,67.97 18.44,68.58 MOTORA.2
  Bottom 0.406: v42.82,60.2 42.82,57.76 50.44,50.14 50.9,50.14 54.41,46.63 54.41,33.83 56.39,31.85 MOTOR_DRIVER.MA2
MA_DR1
  Bottom 0.406: U$1.27 91.44,48.31 89.15,48.31 85.8,51.66 81.99,51.66 78.64,48.31 78.64,41.45 76.5,39.32 75.74,39.32 73.15,36.73 73.15,35.66 71.78,34.29 MOTOR_DRIVER.AIN1
MA_DR2
  Bottom 0.406: U$1.28 91.44,50.9 87.48,50.9 86.11,52.27 81.69,52.27 78.03,48.62 78.03,43.28 76.66,41.91 75.74,41.91 73.15,39.32 73.15,38.25 71.78,36.88 MOTOR_DRIVER.AIN2
MA_ENCA
  Top 0.406: U$1.23/A9 76.2,10.21 63.86,10.21 61.27,12.8 46.02,12.8 41.3,8.08 8.69,8.08 1.22,15.54 1.22,64.62 6.55,69.95 11.89,69.95 13.26,68.58 MOTORA.4
MA_ENCB  (via drill 0.35)
  Top 0.406: v47.09,46.33 47.09,40.54 48.92,38.71 50.14,38.71 52.73,41.3 59.44,41.3 60.05,40.69 60.05,24.23 71.48,12.8 76.2,12.8 U$1.22/A8 | v38.1,55.32 35.97,55.32 v35.05,56.24
  Bottom 0.406: v38.1,55.32 v47.09,46.33 | v35.05,56.24 31.55,56.24 25.3,62.48 25.3,62.64 20.73,67.21 12.19,67.21 10.82,68.58 MOTORA.5
MA_PWM  (via drill 0.35)
  Top 0.406: U$1.29 88.24,50.14 v88.24,47.24 | v86.26,45.26 85.04,45.26 83.52,43.74 77.27,43.74 76.66,44.35 75.74,44.35 v74.68,43.28
  Bottom 0.406: v86.26,45.26 v88.24,47.24 | v74.68,43.28 74.68,42.37 71.78,39.47 MOTOR_DRIVER.PWMA
MAIN_SWT_OUT
  Top 0.406: FQP27P06.S 4.57,62.18 6.55,60.2 9.6,60.2 13.56,56.24 14.48,56.24 R3.2 14.63,56.39 14.63,57.45 17.07,59.89 17.07,60.5 17.98,61.42 18.9,61.42 19.51,60.81 19.51,59.89 18.44,58.83 18.44,56.24 R4.2
  Bottom 0.406: SWTS.2 10.06,11.43 10.06,13.56 2.44,21.18 2.44,60.2 4.42,62.18 FQP27P06.S
MB1  (via drill 0.61)
  Top 0.813: MOTORB.1 90.98,68.58 85.5,74.07 64.01,74.07 v62.79,72.85 | v62.79,68.43 56.84,62.48 51.36,62.48 42.22,53.34 42.22,40.08 54.86,27.43 54.86,23.16 56.39,21.64 MOTOR_DRIVER.MB1
  Bottom 0.813: v62.79,68.43 v62.79,72.85
MB2  (via drill 0.35)
  Top 0.406: MOTORB.2 88.24,68.58 85.95,70.87 v77.57,70.87 | v74.22,60.05 67.06,52.88 67.06,51.36 62.03,46.33 53.8,46.33 v52.43,44.96
  Bottom 0.406: v77.57,70.87 77.57,69.19 74.98,66.6 74.98,60.81 v74.22,60.05 | v52.43,44.96 52.43,28.19 56.39,24.23 MOTOR_DRIVER.MB2
MB_DR1
  Bottom 0.406: U$1.38/A19 76.2,47.4 77.42,46.18 77.42,45.26 76.5,44.35 74.52,44.35 70.26,40.08 70.26,30.63 71.63,29.26 MOTOR_DRIVER.BIN1
MB_DR2
  Bottom 0.406: U$1.37/A18 76.2,49.99 74.52,48.31 74.52,45.26 69.65,40.39 69.65,28.65 71.63,26.67 MOTOR_DRIVER.BIN2
MB_ENCA
  Bottom 0.406: U$1.21/A7 75.29,15.24 72.69,12.65 64.92,12.65 62.33,15.24 62.33,22.86 62.79,23.32 62.79,34.59 55.02,42.37 55.02,48.46 50.29,53.19 49.23,53.19 44.35,58.06 44.35,65.84 42.52,67.67 42.52,73.61 43.59,74.68 77.72,74.68 MOTORB.4
MB_ENCB  (via drill 0.35)
  Top 0.406: v85.5,57.15 v85.5,50.75
  Bottom 0.406: U$1.20/A6 76.2,18.59 81.08,23.47 81.08,24.99 78.94,27.13 77.11,27.13 76.66,26.67 75.74,26.67 74.98,27.43 74.98,33.53 75.74,34.29 76.66,34.29 80.77,38.41 80.77,49.53 81.99,50.75 v85.5,50.75 | v85.5,57.15 85.19,57.45 85.19,58.37 85.5,58.67 85.5,64.47 81.38,68.58 MOTORB.5
MB_PWM  (via drill 0.35)
  Top 0.406: v77.11,52.12 75.74,52.12 72.85,49.23 69.19,49.23 66.9,46.94 66.9,28.96 71.63,24.23 MOTOR_DRIVER.PWMB
  Bottom 0.406: v77.11,52.12 80.62,52.12 81.38,52.88 84.58,52.88 87.48,55.78 91.44,55.78 U$1.30
N$2
  Top 0.406: D2.A 73.3,1.37 73.3,4.42 R10.1
N$3
  Top 0.406: D3.A 65.68,1.37 65.68,4.42 R11.1
N$8  (via drill 0.35)
  Top 0.406: Q1.C 17.22,59.13 17.22,55.78 18.29,54.71 18.29,54.41 R4.1 18.59,54.25 v19.81,54.25
  Bottom 0.406: v19.81,54.25 35.81,54.25 39.32,57.76 39.32,59.59 Q4.3 | FQP27P06.G 9.6,62.18 15.54,62.18 17.37,60.35 18.29,60.35 Q1.C
N$9
  Top 0.406: R5.2 22.25,56.24 24.38,56.24 26.67,58.52 31.24,58.52 32.31,59.59 Q3.3 32.46,59.74 34.59,61.87 38.1,61.87 Q4.2
N$10  (via drill 0.35)
  Top 0.406: v35.81,48.46 v50.14,62.79
  Bottom 0.406: R9.2 68.58,54.1 59.89,62.79 v50.14,62.79 | v35.81,48.46 28.35,48.46 23.16,43.28 D1.C
N$11  (via drill 0.35)
  Top 0.406: C2.2 64.01,50.14 60.35,50.14 C1.2 60.2,49.99 55.02,49.99 53.8,48.77 50.75,48.77 50.6,48.92 48.46,48.92 47.85,48.31 v47.85,48.16 | R9.1 68.58,45.57 v67.82,46.33 | 39.62,57.91 39.78,57.91 40.54,58.67 40.54,61.57 39.01,63.09 32.31,63.09 31.24,62.03 Q3.2 | 39.62,57.91 29.57,57.91 27.89,56.24 26.06,56.24 R6.2 | 39.62,57.91 v39.62,56.39
  Bottom 0.406: v67.82,46.33 64.16,49.99 C2.2 | v39.62,56.39 v47.85,48.16
N$14  (via drill 0.35)
  Top 0.406: v18.9,48.77 25.3,55.17 27.74,55.17 28.65,56.08 29.72,56.08 R13.2 | v18.14,37.34 18.14,32.31 15.39,29.57 15.39,28.04 v32.77,10.67
  Bottom 0.406: v18.9,48.77 18.9,38.1 v18.14,37.34 | v32.77,10.67 39.17,4.27 75.29,4.27 75.74,3.81 77.42,3.81 78.64,5.03 U$1.VUSB
RX_JETSON  (via drill 0.35)
  Top 0.406: v81.69,56.39 81.69,56.08 83.52,54.25 83.52,44.96 v83.21,44.65
  Bottom 0.406: U$1.33/A14 77.11,60.96 v81.69,56.39 | v83.21,44.65 83.21,43.28 83.52,42.98 83.52,31.55 90.22,24.84 90.22,19.81 90.98,19.05 91.9,19.05 94.18,21.34 94.18,28.8 95.86,30.48 JETSON.1
SCL1  (via drill 0.35)
  Top 0.406: v47.24,13.72 61.27,13.72 63.55,11.43 79.1,11.43 79.7,10.82 84.28,10.82 87.33,13.87 91.75,13.87 92.66,14.78 92.66,15.7 91.9,16.46 87.17,16.46 83.36,20.27 76.2,20.27 U$1.19/A5/SCL
  Bottom 0.406: v47.24,13.72 30.63,30.33 25.76,30.33 BATTERY_MONITOR.SCL
SDA1  (via drill 0.35)
  Top 0.406: v63.25,16.31 34.59,16.31 21.95,28.96 BATTERY_MONITOR.SDA
  Bottom 0.406: U$1.18/A4/SDA 76.2,21.95 74.07,19.81 74.07,15.85 72.69,14.48 64.01,14.48 63.25,15.24 v63.25,16.31
SERVO1  (via drill 0.35)
  Top 0.406: v95.1,24.69 94.64,24.23 90.98,24.23 89.92,25.3 76.2,25.3 U$1.17/A3 | v97.23,38.56 97.23,38.86 97.84,39.47 97.84,63.4 95.4,65.84 78.94,65.84 SERVOS.10
  Bottom 0.406: v95.1,24.69 95.1,27.13 97.84,29.87 97.84,37.95 v97.23,38.56
SERVO2  (via drill 0.35)
  Top 0.406: v81.69,49.23 81.69,54.25 79.7,56.24 v78.94,56.24
  Bottom 0.406: U$1.16/A2 76.2,28.8 81.53,34.14 81.53,49.07 v81.69,49.23 | v78.94,56.24 77.57,56.24 76.66,57.15 75.74,57.15 73.3,59.59 73.3,65.08 74.37,66.14 74.37,72.24 73.46,73.15 71.93,73.15 70.56,71.78 SERVOS.7
STEP_ENCA  (via drill 0.35)
  Top 0.406: v80.77,53.49 80.77,51.21 76.5,46.94 v73,46.94 | v59.13,19.2 v59.13,40.39
  Bottom 0.406: v80.77,53.49 84.28,53.49 89.15,58.37 91.44,58.37 U$1.31/A12 | v73,46.94 72.39,46.94 70.71,45.26 65.99,45.26 64.92,46.33 63.25,46.33 61.42,44.5 61.42,42.67 v59.13,40.39 | v59.13,19.2 59.13,17.83 52.73,11.43 STEP_ENC.3
STEP_ENCB  (via drill 0.35)
  Top 0.406: v70.71,54.25 70.71,52.58 65.23,47.09 65.23,26.98 v61.87,23.62
  Bottom 0.406: U$1.32/A13 90.83,60.96 84.28,54.41 76.81,54.41 76.66,54.56 72.08,54.56 71.63,54.1 70.87,54.1 v70.71,54.25 | v61.87,23.62 51.05,12.8 49.07,12.8 47.7,11.43 STEP_ENC.1
TIC_ERR  (via drill 0.35)
  Top 0.406: U$1.15/A1 76.2,31.39 73.15,34.44 73.15,41.15 69.49,44.81 v69.49,48.31 | v66.14,51.66 55.78,51.66 53.8,49.68 v52.58,49.68
  Bottom 0.406: v66.14,51.66 v69.49,48.31 | v52.58,49.68 52.27,49.68 49.38,52.58 48.92,52.58 43.74,57.76 43.74,62.33 37.49,68.58 STEP_CTRL.1
TIC_RST  (via drill 0.35)
  Top 0.406: v79.4,55.32 79.4,52.27 76.66,49.53 74.37,49.53 72.08,47.24 72.08,44.65 74.37,42.37 74.52,42.37 76.2,40.69 U$1.A22/DAC1 | v80.01,66.75 80.01,69.19 79.25,69.95 76.66,69.95 73.46,73.15 64.47,73.15 63.25,71.93 53.03,71.93 52.58,72.39 38.86,72.39 35.05,68.58 STEP_CTRL.2
  Bottom 0.406: v79.4,55.32 81.84,55.32 82.6,56.08 82.6,64.16 v80.01,66.75
TIC_RX  (via drill 0.35)
  Top 0.406: v25.76,72.54 29.72,68.58 STEP_CTRL.4
  Bottom 0.406: U$1.1/TX 81.08,7.62 80.01,6.55 80.01,4.72 76.66,1.37 68.89,1.37 67.51,2.74 62.18,2.74 61.87,2.44 14.33,2.44 1.22,15.54 1.22,64.62 9.14,72.54 v25.76,72.54
TIC_TX  (via drill 0.35)
  Top 0.406: U$1.0/RX 91.44,5.94 96.01,10.52 96.01,24.99 91.75,29.26 90.98,29.26 v87.33,32.92 | v85.34,49.68 84.58,50.44 v84.58,58.98 | v43.89,73.76 37.64,73.76 32.46,68.58 STEP_CTRL.3
  Bottom 0.406: v87.33,32.92 87.33,39.01 85.34,41 v85.34,49.68 | v84.58,58.98 84.58,63.4 80.01,67.97 80.01,69.65 75.89,73.76 v43.89,73.76
TX_JETSON  (via drill 0.35)
  Top 0.406: v79.7,57.15 82.6,54.25 v82.6,47.4 | v86.41,37.03 89.15,34.29 92.05,34.29 94.49,36.73 97.23,36.73 97.84,36.12 97.84,34.9 96.01,33.07 JETSON.2
  Bottom 0.406: v79.7,57.15 78.49,58.37 76.2,58.37 U$1.34/A15 | v82.6,47.4 84.73,45.26 84.73,38.71 v86.41,37.03
UNLATCH  (via drill 0.35)
  Top 0.406: v92.35,44.5 89.76,44.5 87.02,47.24 v87.02,58.37 | v87.02,60.66 77.57,60.66 76.66,59.74 75.74,59.74 74.52,60.96 59.44,60.96 58.06,59.59 v53.49,59.59 | v47.09,56.69 47.09,51.05 43.13,47.09 43.13,44.35 44.2,43.28 D1.A
  Bottom 0.406: U$1.24 91.44,41.45 92.66,42.67 92.66,44.2 v92.35,44.5 | v87.02,60.66 v87.02,58.37 | v53.49,59.59 49.99,59.59 v47.09,56.69
USB_SENSE  (via drill 0.35)
  Top 0.406: R13.1 29.87,54.41 31.85,54.41 33.53,56.08 R14.2 33.68,56.08 34.9,54.86 34.9,46.18 47.09,33.98 v47.09,33.68 | v82.91,22.86 U$1.7 | v67.36,13.56 63.25,17.68 56.24,17.68 v50.29,23.62
  Bottom 0.406: v82.91,22.86 76.5,16.46 75.59,16.46 72.69,13.56 v67.36,13.56 | v50.29,23.62 50.29,31.7 48.31,33.68 v47.09,33.68
V+
  Top 0.406: SERVOS.11 73,69.34 70.56,69.34 SERVOS.8 70.41,69.19 68.12,69.19 SERVOS.5 67.82,69.34 65.53,69.34 SERVOS.2 65.23,69.19 57.61,61.57 52.73,61.57 50.29,59.13 50.29,57.91 6V_REG.VOUT@1
  Bottom 0.406: 6V_REG.VOUT@1 48.77,56.39 48.77,54.56 49.53,53.8 50.6,53.8 55.63,48.77 55.63,42.67 63.4,34.9 63.4,25.45 71.63,17.22 71.63,16.61 MOTOR_DRIVER.VM
VBAT
  Top 0.813: SWTS.1 7.62,14.48 10.97,17.83 10.97,23.47 BATTERY.PWR
VCC  (via drill 0.35)
  Top 0.406: v39.01,69.65 40.84,71.48 v41.6,71.48 52.58,71.48 55.17,68.89 55.17,68.58 FSRS.3 55.32,68.89 56.39,69.95 58.22,69.95 59.59,68.58 FSRS.1 | U$1.3V3 90.07,38.1 89.92,37.95 86.11,37.95 78.64,30.48 v78.64,26.21 | v80.16,24.38 85.5,19.05 91.9,19.05 93.27,17.68 93.27,12.8 91.9,11.43 86.26,11.43 81.23,6.4 v81.08,6.4 72.24,6.4 70.41,4.57 R10.2 70.26,4.57 v69.19,5.64 | v86.11,57.91 86.41,57.61 86.41,46.33 v89.92,42.82
  Bottom 0.406: 89.99,65 86.41,68.58 MOTORB.3 86.26,68.73 85.5,68.73 78.94,75.29 43.28,75.29 41.6,73.61 v41.6,71.48 | 89.99,65 94.64,60.35 95.86,60.35 DISP.9 | MOTORA.3 16.61,68.58 17.98,69.95 38.71,69.95 v39.01,69.65 | STEP_ENC.2 49.84,11.43 48.46,10.06 46.79,10.06 41.38,15.47 | 41.38,15.47 29.57,27.28 29.57,28.96 BATTERY_MONITOR.VCC | v81.08,6.4 82.45,6.4 86.26,2.59 IR.3 | 78.49,26.06 76.5,24.08 75.74,24.08 73.15,21.49 73.15,20.42 71.78,19.05 MOTOR_DRIVER.VCC | 78.49,26.06 v80.16,24.38 | 78.49,26.06 v78.64,26.21 | 41.38,15.47 38.1,12.19 38.1,10.82 43.28,5.64 v69.19,5.64 | 89.99,65 86.11,61.11 v86.11,57.91 | v89.92,42.82 89.92,39.78 91.44,38.25 U$1.3V3
VSS  (via drill 0.61)
  Top 0.813: 6V_REG.VIN@1 57.76,57.76 57.76,55.32 6V_REG.VIN@2 57.76,54.86 53.65,50.75 48.92,50.75 46.02,47.85 v46.02,37.95 | 12V_REG.VIN1 16.61,42.52 16.61,40.08 12V_REG.VIN2 16.92,40.08 19.2,37.8 19.2,33.22 | 19.2,33.22 19.2,28.96 BATTERY_MONITOR.VIN- | 43.59,33.22 46.33,30.48 5V_REG.VIN | 19.2,33.22 43.59,33.22 | v43.74,35.66 43.74,33.53 43.59,33.22
  Bottom 0.813: v43.74,35.66 v46.02,37.95

### Text on the board
bNames: Benjamin Warwick 2020 | Dodobot, Rev 2